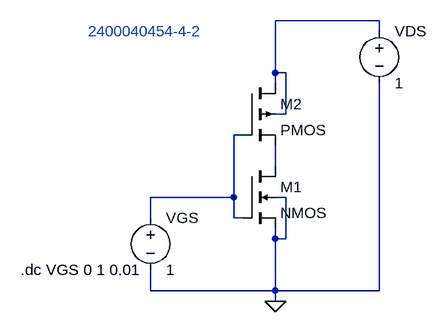
[diagram p0: schematic lab2.asc]
lab2.asc, the LTspice schematic file:
Version 4.1
SHEET 1 880 680
WIRE 448 -48 288 -48
WIRE 448 -32 448 -48
WIRE 288 32 288 -48
WIRE 304 32 288 32
WIRE 288 48 288 32
WIRE 304 96 304 32
WIRE 304 96 288 96
WIRE 240 128 224 128
WIRE 288 176 288 144
WIRE 224 224 224 128
WIRE 224 224 96 224
WIRE 304 224 288 224
WIRE 96 256 96 224
WIRE 224 256 224 224
WIRE 240 256 224 256
WIRE 288 288 288 272
WIRE 304 288 304 224
WIRE 304 288 288 288
WIRE 96 368 96 336
WIRE 288 368 288 288
WIRE 288 368 96 368
WIRE 448 368 448 48
WIRE 448 368 288 368
WIRE 288 384 288 368
FLAG 288 384 0
SYMBOL nmos4 240 176 R0
SYMATTR InstName M1
SYMATTR Value2 l=40nm w=10u
SYMBOL pmos4 240 48 R0
SYMATTR InstName M2
SYMATTR Value2 l=60u w=20u
SYMBOL voltage 96 240 R0
SYMATTR InstName VGS
SYMATTR Value 1
SYMBOL voltage 448 -48 R0
SYMATTR InstName VDS
SYMATTR Value 1
TEXT -104 336 Left 2 !.dc VGS 0 1 0.01
TEXT 0 -32 Left 2 ;2400040454-4-2

The netlist it stands for:
* lab2.asc
M1 N003 N002 0 0 NMOS l=40nm w=10u
M2 N001 N002 N003 N001 PMOS l=60u w=20u
VGS N002 0 1
VDS N001 0 1
.model NMOS NMOS
.model PMOS PMOS
.lib standard.mos
.dc VGS 0 1 0.01
* 2400040454-4-2
.backanno
.end